# Altium project Course work.PrjPcb (part 2 of 3)
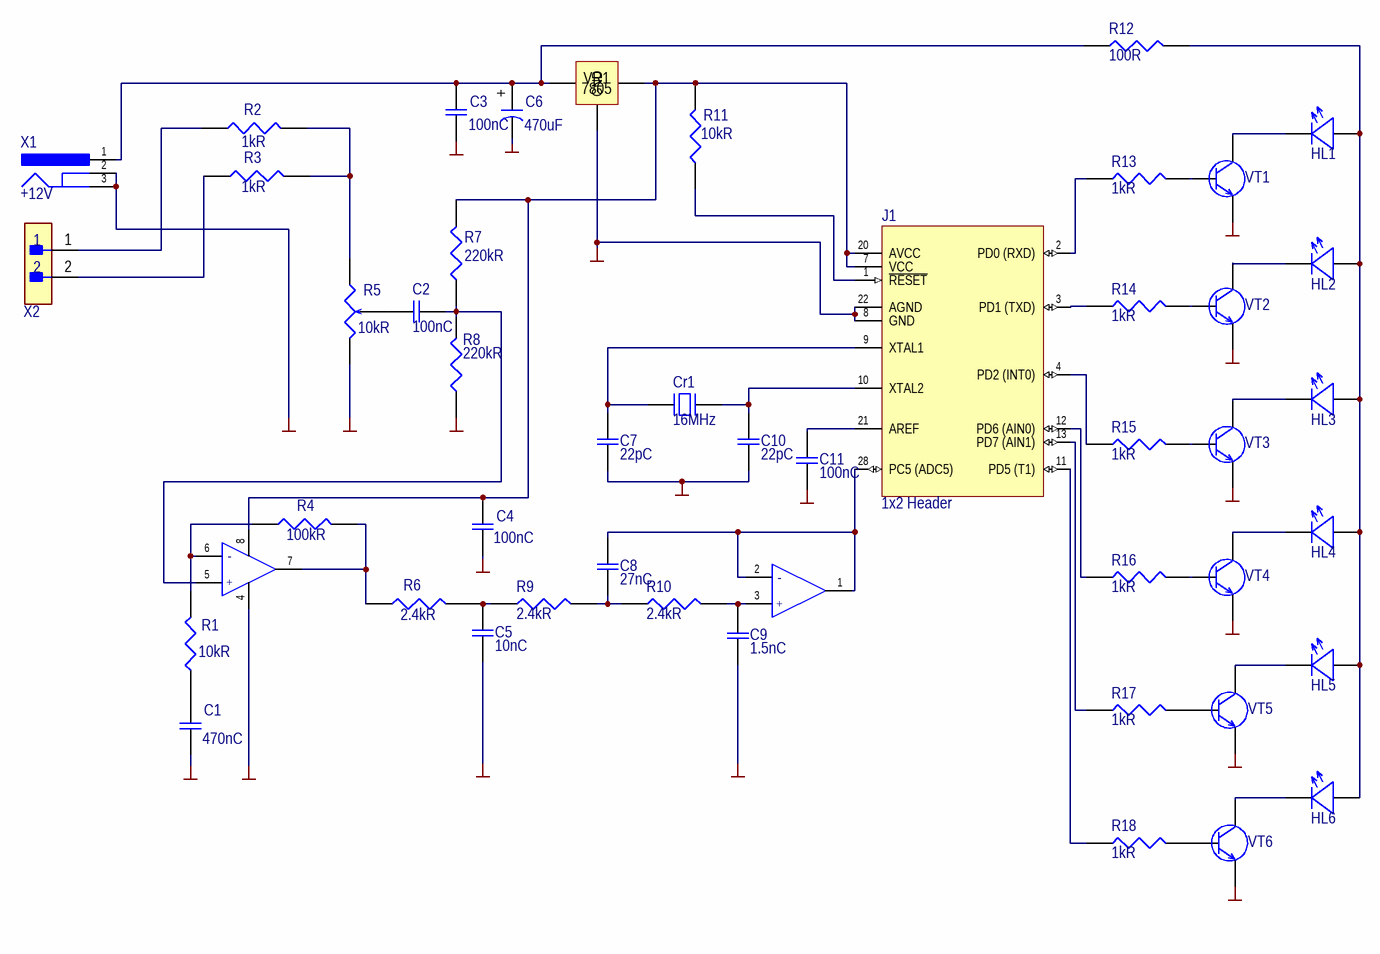
[diagram p1: CW.SchDoc]

## Sheet CW.SchDoc (continued)
### Library data of the parts
C1 = C0805YC474KAT2A: CAP, X7R, 470NF, 16V, 0805, FULL REEL; Manufacturer: Kyocera AVX; Tolerance: 10%; Dissipation Factor: 3.5%; Insulation Resistance: 100GR; Supplier 1: Digi-Key; Supplier Part Number 1: 478-1403-1-ND; Manufacturer Part Number: 0805YC474KAT2A; RoHS: Yes; Category: Ceramic Capacitors; Stock 1: 8545; Pricing 1: 1=0,27000, 10=0,18100, 50=0,10840, 100=0,09160, 500=0,06268, 1000=0,05544 (USD); Mount: Surface Mount,PCB; Case/Package: 0805; Number of Pins: 2; Case Code (Imperial): 0805; Case Code (Metric): 2012; Contact Plating: Tin,Matte; Min Operating Temperature: -55°C; Max Operating Temperature: 125°C; Packaging: Tape and Reel; Capacitance: 470nF; Voltage Rating: 16V; Dielectric: X7R; Voltage: 16V; Voltage Rating (DC): 16V; Package Quantity: 1; Termination: SMD/SMT; Series: -; Construction: Flat; Length: 2.01mm; Width: 1.25mm; Height: 1.4mm; Depth: 1.25mm; Thickness: 0.055inch; Size: 1.4mm; Radiation Hardening: No; RoHS Compliant: Yes; REACH SVHC: No SVHC; Lead Free: Lead Free; ComponentLink1URL: https://datasheet.ciiva.com/19476/2011221-19476183.pdf?src-supplier=Jameco; ComponentLink1Description: https://datasheet.ciiva.com/19476/2011221-19476183.pdf?src-supplier=Jameco; ComponentLink2URL: https://datasheet.ciiva.com/11786/0900766b80ed4be2-11786321.pdf?src-supplier=RSComponents; ComponentLink2Description: https://datasheet.ciiva.com/11786/0900766b80ed4be2-11786321.pdf?src-supplier=RSComponents; ComponentLink3URL: https://datasheet.ciiva.com/2988/cx7r-2988058.pdf?src-supplier=Avnet; ComponentLink3Description: https://datasheet.ciiva.com/2988/cx7r-2988058.pdf?src-supplier=Avnet; ComponentLink4URL: https://datasheet.ciiva.com/16326/cx7r-16326277.pdf?src-supplier=Future+Electronics; ComponentLink4Description: https://datasheet.ciiva.com/16326/cx7r-16326277.pdf?src-supplier=Future+Electronics; ComponentLink5URL: https://datasheet.ciiva.com/16623/cx7r-16623416.pdf?src-supplier=Avnet+Europe; ComponentLink5Description: https://datasheet.ciiva.com/16623/cx7r-16623416.pdf?src-supplier=Avnet+Europe; ComponentLink6URL: https://datasheet.ciiva.com/16544/cx7r-16544108.pdf?src-supplier=Avnet+Asia; ComponentLink6Description: https://datasheet.ciiva.com/16544/cx7r-16544108.pdf?src-supplier=Avnet+Asia; ComponentLink7URL: https://datasheet.ciiva.com/7812/cx7r-7812207.pdf?src-supplier=Element14; ComponentLink7Description: https://datasheet.ciiva.com/7812/cx7r-7812207.pdf?src-supplier=Element14; ComponentLink8URL: https://datasheet.ciiva.com/152/cx7r-152109.pdf?src-supplier=Digi-Key; ComponentLink8Description: https://datasheet.ciiva.com/152/cx7r-152109.pdf?src-supplier=Digi-Key; ComponentLink9URL: https://datasheet.ciiva.com/152/cx7r-152108.pdf?src-supplier=Digi-Key; ComponentLink9Description: https://datasheet.ciiva.com/152/cx7r-152108.pdf?src-supplier=Digi-Key; ComponentLink10URL: https://datasheet.ciiva.com/152/cx7r-152110.pdf?src-supplier=Digi-Key; ComponentLink10Description: https://datasheet.ciiva.com/152/cx7r-152110.pdf?src-supplier=Digi-Key; ComponentLink11URL: https://datasheet.ciiva.com/5416/cx7r-218113-5416693.pdf?src-supplier=Mouser; ComponentLink11Description: https://datasheet.ciiva.com/5416/cx7r-218113-5416693.pdf?src-supplier=Mouser; ComponentLink12URL: https://datasheet.ciiva.com/14590/70001075-14590213.pdf?src-supplier=Allied+Electronics; ComponentLink12Description: https://datasheet.ciiva.com/14590/70001075-14590213.pdf?src-supplier=Allied+Electronics; ComponentLink13URL: https://datasheet.ciiva.com/14602/70001075-14602165.pdf?src-supplier=Allied+Electronics; ComponentLink13Description: https://datasheet.ciiva.com/14602/70001075-14602165.pdf?src-supplier=Allied+Electronics
C2-C4 C11 = C0805C104M4VACTU: CAP CER 0.1UF 16V 20% Y5V 0805; Manufacturer: KEMET; Dielectric Material: Ceramic; Capacitance: 100nF; Dissipation Factor: 7%; Supplier 1: Digi-Key; Supplier Part Number 1: 399-9156-1-ND; Manufacturer Part Number: C0805C104M4VACTU; RoHS: Yes; Category: Ceramic Capacitors; Stock 1: 9052; Pricing 1: 1=0,13000, 10=0,09600, 50=0,05440, 100=0,04500, 500=0,03156, 1000=0,02613 (USD); Mount: Surface Mount; Case/Package: 0805; Case Code (Metric): 2012; Case Code (Imperial): 0805; Min Operating Temperature: -30°C; Max Operating Temperature: 85°C; Package Quantity: 1; Voltage Rating: 16V; Tolerance: 20%; Packaging: Tape and Reel; Voltage Rating (DC): 16V; Dielectric: Y5V; Termination: SMD/SMT; Series: C; Length: 0.079inch; Width: 0.049inch; Height: 0.9mm; Thickness: 0.035inch; Lead Pitch: 0.75mm; Depth: 1.25mm; Lead Free: Lead Free; RoHS Compliant: Yes; ComponentLink1URL: http://www.mouser.com/ds/2/212/KEM_C1005_Y5V_SMD-1101305.pdf?src-supplier=Mouser; ComponentLink1Description: http://www.mouser.com/ds/2/212/KEM_C1005_Y5V_SMD-1101305.pdf?src-supplier=Mouser; ComponentLink2URL: https://api.kemet.com/component-edge/download/datasheet/C0805C104M4VACTU.pdf?src-supplier=Digi-Key; ComponentLink2Description: https://api.kemet.com/component-edge/download/datasheet/C0805C104M4VACTU.pdf?src-supplier=Digi-Key
C5 = CC0402KRX7R7BB103: CAP CER 10000PF 16V X7R 0402; Manufacturer: Yageo; Capacitance: 10nF; Tolerance: 10%; Insulation Resistance: 10GR; Dissipation Factor: 3.5%; Supplier 1: Future Electronics; Supplier Part Number 1: 9410754; Manufacturer Part Number: CC0402KRX7R7BB103; RoHS: Yes; Category: Ceramic Capacitors; Stock 1: 39464018; Pricing 1: 1=0,00300, 500=0,00220, 1500=0,00210, 2500=0,00200, 5000=0,00200 (USD); Mount: Surface Mount; Case/Package: 0402; Number of Pins: 2; Case Code (Metric): 1005; Case Code (Imperial): 0402; Min Operating Temperature: -55°C; Max Operating Temperature: 125°C; Packaging: Tape and Reel; Voltage Rating (DC): 16V; Dielectric: X7R; Voltage: 16V; Package Quantity: 1; Voltage Rating: 16V; Termination: SMD/SMT; Series: CC; Length: 1mm; Width: 0.02inch; Height: 0.5mm; Thickness: 0.022inch; Depth: 0.5mm; Radiation Hardening: No; REACH SVHC: No SVHC; Lead Free: Lead Free; RoHS Compliant: Yes; Halogen Free: Halogen Free; ComponentLink1URL: https://datasheet.ciiva.com/143/upy-gphc-x7r-6-3v-to-50v-8-143952.pdf?src-supplier=Digi-Key; ComponentLink1Description: https://datasheet.ciiva.com/143/upy-gphc-x7r-6-3v-to-50v-8-143952.pdf?src-supplier=Digi-Key; ComponentLink2URL: https://datasheet.ciiva.com/143/mlccorderingcode-143950.pdf?src-supplier=Digi-Key; ComponentLink2Description: https://datasheet.ciiva.com/143/mlccorderingcode-143950.pdf?src-supplier=Digi-Key; ComponentLink3URL: https://datasheet.ciiva.com/143/mlccorderingcode-143951.pdf?src-supplier=Digi-Key; ComponentLink3Description: https://datasheet.ciiva.com/143/mlccorderingcode-143951.pdf?src-supplier=Digi-Key; ComponentLink4URL: https://datasheet.ciiva.com/16625/upy-gphc-x7r-6-3v-to-50v-8-16625510.pdf?src-supplier=Avnet+Europe; ComponentLink4Description: https://datasheet.ciiva.com/16625/upy-gphc-x7r-6-3v-to-50v-8-16625510.pdf?src-supplier=Avnet+Europe; ComponentLink5URL: https://datasheet.ciiva.com/8033/70765-8033655.pdf?src-supplier=Element14; ComponentLink5Description: https://datasheet.ciiva.com/8033/70765-8033655.pdf?src-supplier=Element14; ComponentLink6URL: https://datasheet.ciiva.com/8033/1489800-8033658.pdf?src-supplier=Element14; ComponentLink6Description: https://datasheet.ciiva.com/8033/1489800-8033658.pdf?src-supplier=Element14; ComponentLink7URL: https://datasheet.ciiva.com/28450/1489800-28450330.pdf?src-supplier=Element14; ComponentLink7Description: https://datasheet.ciiva.com/28450/1489800-28450330.pdf?src-supplier=Element14; ComponentLink8URL: https://datasheet.ciiva.com/8033/1489800-8033659.pdf?src-supplier=Element14; ComponentLink8Description: https://datasheet.ciiva.com/8033/1489800-8033659.pdf?src-supplier=Element14; ComponentLink9URL: https://datasheet.ciiva.com/7978/1489800-7978109.pdf?src-supplier=Element14; ComponentLink9Description: https://datasheet.ciiva.com/7978/1489800-7978109.pdf?src-supplier=Element14; ComponentLink10URL: https://datasheet.ciiva.com/5425/upy-gp-np0-16v-to-50v-8-3714-5425438.pdf?src-supplier=Mouser; ComponentLink10Description: https://datasheet.ciiva.com/5425/upy-gp-np0-16v-to-50v-8-3714-5425438.pdf?src-supplier=Mouser
C6 = EEEFK1C471P: PANASONIC - EEEFK1C471P - SMD Aluminum Electrolytic Capacitor, Radial Can - SMD, 470 µF, 16 V, FK Series, 2000 hours @ 105°C; Dielectric Material: Aluminium; Voltage Rating: 16V; Ripple Current: 600mA; Tolerance: 20%; Leakage Current: 3uA; ESR (Equivalent Series Resistance): 160mR; Supplier 1: RSComponents; Supplier Part Number 1: 5370477P; Manufacturer: Panasonic; Manufacturer Part Number: EEEFK1C471P; RoHS: Yes; Category: Aluminum Electrolytic Capacitors; Stock 1: 30580; Pricing 1: 50=0,38600, 150=0,32900 (USD); Mount: Surface Mount,PCB; Case/Package: Radial; Number of Pins: 2; Contact Plating: Tin; Material: Aluminium; Min Operating Temperature: -55°C; Max Operating Temperature: 105°C; Capacitance: 470uF; Packaging: Tape and Reel; Package Quantity: 1; Voltage Rating (DC): 16V; Life (Hours): 2000Hour; Termination: SMD/SMT; Ripple Current (AC): 600mA; Series: FK; Construction: Cylindrical; Voltage: 16V; Impedance: 160mR; Diameter: 8mm; Length: 10.2mm; Width: 10mm; Height: 10.2mm; Height - Seated (Max): 0.402inch; Radiation Hardening: No; REACH SVHC: No SVHC; Lead Free: Lead Free; RoHS Compliant: Yes; ComponentLink1URL: https://datasheet.ciiva.com/11777/0900766b80e4e8b0-11777355.pdf?src-supplier=RSComponents; ComponentLink1Description: https://datasheet.ciiva.com/11777/0900766b80e4e8b0-11777355.pdf?src-supplier=RSComponents; ComponentLink2URL: https://datasheet.ciiva.com/29313/443466-da-01-en-smd-elko-vfk-f-470-uf-16v-29313494.pdf?src-supplier=Conrad; ComponentLink2Description: https://datasheet.ciiva.com/29313/443466-da-01-en-smd-elko-vfk-f-470-uf-16v-29313494.pdf?src-supplier=Conrad; ComponentLink3URL: https://datasheet.ciiva.com/15165/getdatasheetpartid-85020-15165862.pdf?src-supplier=Verical; ComponentLink3Description: https://datasheet.ciiva.com/15165/getdatasheetpartid-85020-15165862.pdf?src-supplier=Verical; ComponentLink4URL: https://datasheet.ciiva.com/2983/aba0000ce120-2983946.pdf?src-supplier=Avnet; ComponentLink4Description: https://datasheet.ciiva.com/2983/aba0000ce120-2983946.pdf?src-supplier=Avnet; ComponentLink5URL: https://datasheet.ciiva.com/14592/70258115-14592955.pdf?src-supplier=Allied+Electronics; ComponentLink5Description: https://datasheet.ciiva.com/14592/70258115-14592955.pdf?src-supplier=Allied+Electronics; ComponentLink6URL: https://datasheet.ciiva.com/6121/1676921-6121148.pdf?src-supplier=Farnell; ComponentLink6Description: https://datasheet.ciiva.com/6121/1676921-6121148.pdf?src-supplier=Farnell; ComponentLink7URL: https://datasheet.ciiva.com/14595/70258115-14595868.pdf?src-supplier=Allied+Electronics; ComponentLink7Description: https://datasheet.ciiva.com/14595/70258115-14595868.pdf?src-supplier=Allied+Electronics; ComponentLink8URL: https://datasheet.ciiva.com/30213/aba0000ce120-30213244.pdf?src-supplier=Onlinecomponents.com; ComponentLink8Description: https://datasheet.ciiva.com/30213/aba0000ce120-30213244.pdf?src-supplier=Onlinecomponents.com; ComponentLink9URL: https://datasheet.ciiva.com/46376/1676921-46376492.pdf?src-supplier=Element14; ComponentLink9Description: https://datasheet.ciiva.com/46376/1676921-46376492.pdf?src-supplier=Element14; ComponentLink10URL: https://datasheet.ciiva.com/2985/aba0000ce120-2985405.pdf?src-supplier=Avnet; ComponentLink10Description: https://datasheet.ciiva.com/2985/aba0000ce120-2985405.pdf?src-supplier=Avnet; ComponentLink11URL: https://datasheet.ciiva.com/25899/aba0000ce120-25899342.pdf?src-supplier=Avnet+Europe; ComponentLink11Description: https://datasheet.ciiva.com/25899/aba0000ce120-25899342.pdf?src-supplier=Avnet+Europe
C7 C10 = C1206C220J5GACTU: 1206 22pF Ceramic Multilayer Capacitor; 50VDC; 125degC; C0G Dielec; +/-5% SMD; Manufacturer: KEMET; Tolerance: 5%; Voltage Rating: 50V; Temperature Coefficient: 30ppm/°C; Dissipation Factor: 0.1%; Supplier 1: Digi-Key; Supplier Part Number 1: 399-1197-1-ND; Manufacturer Part Number: C1206C220J5GACTU; RoHS: Yes; Category: Ceramic Capacitors; Stock 1: 60049; Pricing 1: 1=0,25000, 10=0,16700, 50=0,10040, 100=0,08480, 500=0,05800, 1000=0,05131 (USD); Mount: Surface Mount,PCB; Case/Package: 1206; Case Code (Imperial): 1206; Case Code (Metric): 3216; Dielectric Material: Ceramic; Contact Material: Tin; Min Operating Temperature: -55°C; Max Operating Temperature: 125°C; Capacitance: 22pF; Packaging: Tape and Reel; Dielectric: C0G; Termination: SMD/SMT; Package Quantity: 1; Voltage: 50V; Voltage Rating (DC): 50V; Series: C; Construction: Flat; Length: 3.2mm; Width: 1.6mm; Height: 0.78mm; Depth: 1.6mm; Thickness: 0.035inch; Radiation Hardening: No; REACH SVHC: No SVHC; RoHS Compliant: Yes; Lead Free: Lead Free; ComponentLink1URL: https://datasheet.ciiva.com/6177/1776099-6177664.pdf?src-supplier=Farnell; ComponentLink1Description: https://datasheet.ciiva.com/6177/1776099-6177664.pdf?src-supplier=Farnell; ComponentLink2URL: https://datasheet.ciiva.com/145/docfinderpartnumber-c1206c220j5gactu-145591.pdf?src-supplier=Digi-Key; ComponentLink2Description: https://datasheet.ciiva.com/145/docfinderpartnumber-c1206c220j5gactu-145591.pdf?src-supplier=Digi-Key; ComponentLink3URL: https://datasheet.ciiva.com/7729/1776099-7729850.pdf?src-supplier=Element14; ComponentLink3Description: https://datasheet.ciiva.com/7729/1776099-7729850.pdf?src-supplier=Element14; ComponentLink4URL: https://datasheet.ciiva.com/28668/1789732-28668845.pdf?src-supplier=Element14; ComponentLink4Description: https://datasheet.ciiva.com/28668/1789732-28668845.pdf?src-supplier=Element14; ComponentLink5URL: https://datasheet.ciiva.com/14593/70095383-14593639.pdf?src-supplier=Allied+Electronics; ComponentLink5Description: https://datasheet.ciiva.com/14593/70095383-14593639.pdf?src-supplier=Allied+Electronics; ComponentLink6URL: https://datasheet.ciiva.com/14608/70095383-14608661.pdf?src-supplier=Allied+Electronics; ComponentLink6Description: https://datasheet.ciiva.com/14608/70095383-14608661.pdf?src-supplier=Allied+Electronics; ComponentLink7URL: https://datasheet.ciiva.com/2988/kem-c1003-c0g-smd-2988752.pdf?src-supplier=Avnet; ComponentLink7Description: https://datasheet.ciiva.com/2988/kem-c1003-c0g-smd-2988752.pdf?src-supplier=Avnet; ComponentLink8URL: https://datasheet.ciiva.com/2988/kem-c1003-c0g-smd-2988751.pdf?src-supplier=Avnet; ComponentLink8Description: https://datasheet.ciiva.com/2988/kem-c1003-c0g-smd-2988751.pdf?src-supplier=Avnet; ComponentLink9URL: https://datasheet.ciiva.com/18102/getdatasheetpartid-68144-18102364.pdf?src-supplier=Verical; ComponentLink9Description: https://datasheet.ciiva.com/18102/getdatasheetpartid-68144-18102364.pdf?src-supplier=Verical; ComponentLink10URL: https://datasheet.ciiva.com/11649/kem-c1003-c0g-smd-11649994.pdf?src-supplier=Avnet; ComponentLink10Description: https://datasheet.ciiva.com/11649/kem-c1003-c0g-smd-11649994.pdf?src-supplier=Avnet
C8 = C0805C273K5RACTU: CAP CER 0.027UF 50V X7R 0805; Manufacturer: KEMET; Dielectric Material: Ceramic; Capacitance: 27nF; Tolerance: 10%; Dissipation Factor: 2.5%; Supplier 1: Digi-Key; Supplier Part Number 1: 399-1164-1-ND; Manufacturer Part Number: C0805C273K5RACTU; RoHS: Yes; Category: Ceramic Capacitors; Stock 1: 100815; Pricing 1: 1=0,11000, 10=0,08100, 50=0,04580, 100=0,03800, 500=0,02666, 1000=0,02207 (USD); Mount: Surface Mount,PCB; Case/Package: 0805; Number of Pins: 2; Case Code (Metric): 2012; Case Code (Imperial): 0805; Min Operating Temperature: -55°C; Max Operating Temperature: 125°C; Voltage Rating: 50V; Packaging: Tape and Reel; Package Quantity: 1; Voltage Rating (DC): 50V; Dielectric: X7R; Termination: SMD/SMT; Series: C; Construction: Flat; Voltage: 50V; Length: 2mm; Width: 0.049inch; Height: 0.78mm; Thickness: 0.035inch; Depth: 1.25mm; Lead Pitch: 0.75mm; Radiation Hardening: No; RoHS Compliant: Yes; REACH SVHC: No SVHC; ComponentLink1URL: https://datasheet.ciiva.com/14593/70095383-14593543.pdf?src-supplier=Allied+Electronics; ComponentLink1Description: https://datasheet.ciiva.com/14593/70095383-14593543.pdf?src-supplier=Allied+Electronics; ComponentLink2URL: https://datasheet.ciiva.com/14592/70095383-14592123.pdf?src-supplier=Allied+Electronics; ComponentLink2Description: https://datasheet.ciiva.com/14592/70095383-14592123.pdf?src-supplier=Allied+Electronics; ComponentLink3URL: https://datasheet.ciiva.com/7842/1918693-7842589.pdf?src-supplier=Element14; ComponentLink3Description: https://datasheet.ciiva.com/7842/1918693-7842589.pdf?src-supplier=Element14; ComponentLink4URL: https://datasheet.ciiva.com/7842/kem-c1002-x7r-smd-7842590.pdf?src-supplier=Element14; ComponentLink4Description: https://datasheet.ciiva.com/7842/kem-c1002-x7r-smd-7842590.pdf?src-supplier=Element14
C9 = C08051C152KAT2A: 0805 1.5nF Ceramic Multilayer Capacitor,  100 VDC,  +125degC,  X7R Dielec,  +/-10%; Manufacturer: Kyocera AVX; Tolerance: 10%; Voltage Rating (DC): 100V; Dissipation Factor: 2.5%; Insulation Resistance: 100GR; Supplier 1: Digi-Key; Supplier Part Number 1: 478-1353-1-ND; Manufacturer Part Number: 08051C152KAT2A; RoHS: Yes; Category: Ceramic Capacitors; Stock 1: 214; Pricing 1: 1=0,19000, 10=0,13200, 50=0,07480, 100=0,06200, 500=0,04350, 1000=0,03601 (USD); Mount: Surface Mount,PCB; Case/Package: 0805; Number of Pins: 2; Case Code (Metric): 2012; Case Code (Imperial): 0805; Dielectric Material: Ceramic; Contact Plating: Tin,Matte; Min Operating Temperature: -55°C; Max Operating Temperature: 125°C; Packaging: Tape and Reel; Capacitance: 1.5nF; Package Quantity: 1; Dielectric: X7R; Voltage Rating: 100V; Termination: SMD/SMT; Voltage: 100V; Length: 2.01mm; Width: 0.049inch; Height: 0.94mm; Thickness: 0.037inch; Depth: 1.25mm; Radiation Hardening: No; RoHS Compliant: Yes; REACH SVHC: No SVHC; Lead Free: Lead Free; ComponentLink1URL: https://datasheet.ciiva.com/150/cx7r-150629.pdf?src-supplier=Digi-Key; ComponentLink1Description: https://datasheet.ciiva.com/150/cx7r-150629.pdf?src-supplier=Digi-Key; ComponentLink2URL: https://datasheet.ciiva.com/150/cx7r-150630.pdf?src-supplier=Digi-Key; ComponentLink2Description: https://datasheet.ciiva.com/150/cx7r-150630.pdf?src-supplier=Digi-Key; ComponentLink3URL: https://datasheet.ciiva.com/150/cx7r-150631.pdf?src-supplier=Digi-Key; ComponentLink3Description: https://datasheet.ciiva.com/150/cx7r-150631.pdf?src-supplier=Digi-Key; ComponentLink4URL: https://datasheet.ciiva.com/7811/cx7r-7811928.pdf?src-supplier=Element14; ComponentLink4Description: https://datasheet.ciiva.com/7811/cx7r-7811928.pdf?src-supplier=Element14; ComponentLink5URL: https://datasheet.ciiva.com/7811/cx7r-7811929.pdf?src-supplier=Element14; ComponentLink5Description: https://datasheet.ciiva.com/7811/cx7r-7811929.pdf?src-supplier=Element14; ComponentLink6URL: https://datasheet.ciiva.com/7811/cx7r-7811930.pdf?src-supplier=Element14; ComponentLink6Description: https://datasheet.ciiva.com/7811/cx7r-7811930.pdf?src-supplier=Element14
Cr1 = ATS16ASM-1: CRYSTAL 16.0MHZ 20PF SMD; Manufacturer: CTS; Frequency Tolerance: 30ppm; ESR (Equivalent Series Resistance): 40R; Frequency Stability: 50ppm; Supplier 1: Digi-Key; Supplier Part Number 1: CTX1440CT-ND; Manufacturer Part Number: ATS16ASM-1; RoHS: Yes; Category: Crystals; Stock 1: 949; Pricing 1: 1=0,37000, 10=0,30500, 50=0,27440, 100=0,24400, 500=0,23180 (USD); Mount: Surface Mount; Number of Pins: 2; Min Operating Temperature: -20°C; Max Operating Temperature: 70°C; Frequency: 16MHz; Load Capacitance: 20pF; Packaging: Tape and Reel; Package Quantity: 1000; Tolerance: 30ppm; Termination: SMD/SMT; Series: ATS-SM; Series Resistance: 40R; Length: 0.437inch; Width: 0.19inch; Height: 0.169inch; RoHS Compliant: Yes; ComponentLink1URL: https://datasheet.ciiva.com/861/008-0309-0-861005.pdf?src-supplier=Digi-Key; ComponentLink1Description: https://datasheet.ciiva.com/861/008-0309-0-861005.pdf?src-supplier=Digi-Key
DA1 = LM358N/NOPB (1): TEXAS INSTRUMENTS   LM358N/NOPB..   OP AMP, 1MHZ, 0.1V/S, 7MV, DIP8; Manufacturer: TI National Semiconductor; Slew Rate: 0.1V/µs; Operating Supply Voltage: 16V; Max Supply Voltage: 32V; Min Supply Voltage: 3V; Nominal Supply Current: 500uA; Common Mode Rejection Ratio: 65dB; Voltage Gain: 100dB; Min Dual Supply Voltage: 1.5V; Max Power Dissipation: 830mW; Number of Channels: 2; Output Current: 30mA; Input Bias Current: 250nA; Operating Supply Current: 1mA; Output Current per Channel: 40mA; Max Supply Current: 1.2mA; Supplier 1: Digi-Key; Manufacturer Part Number: LM358N/NOPB; RoHS: Yes; Category: Amplifiers - Op Amps, Buffer, Instrumentation; Stock 1: 24976; Pricing 1: 1=1,00000, 10=0,89100, 25=0,84600, 100=0,69480, 250=0,64952, 500=0,57400, 1000=0,47595 (USD); Mount: Through Hole; Case/Package: PDIP; Number of Pins: 8; Weight: 0.01lb; Min Operating Temperature: 0°C; Max Operating Temperature: 70°C; Bandwidth: 1MHz; Packaging: Rail/Tube; Unity Gain Bandwidth Product: 1MHz; Package Quantity: 40; Max Dual Supply Voltage: 16V; Number of Circuits: 2; Gain Bandwidth Product: 1MHz; Input Offset Voltage (Vos): 7mV; Number of Amplifiers: 2; Number of Elements: 2; Power Dissipation: 830mW; Power Supply Rejection Ratio (PSRR): 65dB; Length: 9.27mm; Width: 6.35mm; Height: 3.3mm; Radiation Hardening: No; REACH SVHC: No SVHC; Lead Free: Lead Free; Supplier Part Number 1: LM358NNS/NOPB-ND
DA2 = LM7805CT/NOPB: Series 3-Terminal Positive Regulators; Manufacturer: Texas Instruments; Number of Outputs: 1; Quiescent Current: 8mA; Output Type: Fixed; Max Input Voltage: 35V; Max Output Current: 1A; Dropout Voltage: 2V; Min Input Voltage: 10V; Accuracy: 2%; Supplier 1: Digi-Key; Manufacturer Part Number: LM7805CT/NOPB; RoHS: Yes; Category: Voltage Regulators - Linear; Stock 1: 13155; Pricing 1: 1=1,63000, 10=1,46300, 25=1,38080, 100=1,17630, 250=1,10452, 500=0,96646, 1000=0,87007 (USD); Mount: Through Hole; Case/Package: TO-220; Number of Pins: 3; Min Operating Temperature: 0°C; Max Operating Temperature: 125°C; Packaging: Rail/Tube; Package Quantity: 45; Polarity: Positive; Series: -; Output Voltage: 5V; Output Current: 1A; Number of Regulators: 1; Output Voltage Accuracy: 2%; Length: 10.16mm; Width: 4.7mm; Height: 8.89mm; Radiation Hardening: No; Lead Free: Contains Lead; RoHS Compliant: Yes; ComponentLink1URL: https://datasheet.ciiva.com/45987/902071-45987836.pdf?src-supplier=Jameco; ComponentLink1Description: https://datasheet.ciiva.com/45987/902071-45987836.pdf?src-supplier=Jameco; ComponentLink2URL: https://datasheet.ciiva.com/15083/lm7805c-15083790.pdf?src-supplier=Digi-Key; ComponentLink2Description: https://datasheet.ciiva.com/15083/lm7805c-15083790.pdf?src-supplier=Digi-Key; ComponentLink3URL: https://datasheet.ciiva.com/14280/lm340-n-14280911.pdf?src-supplier=Avnet; ComponentLink3Description: https://datasheet.ciiva.com/14280/lm340-n-14280911.pdf?src-supplier=Avnet; Supplier Part Number 1: 296-47192-ND
HL1 HL3 = 151051RS11000: WURTH ELEKTRONIK - 151051RS11000 - LED, Red, Through Hole, T-1 3/4 (5mm), 30 mA, 2.1 V, 630 nm; Manufacturer: Wurth Electronics; Forward Voltage: 2.1V; Test Current: 20mA; Luminous Intensity: 30mcd; Viewing Angle: 60°; Lens Style: Diffused,Round,Circular; Dominant Wavelength: 645nm; Forward Current: 30mA; Wavelength: 630nm; Supplier 1: Digi-Key; Supplier Part Number 1: 732-5016-ND; Manufacturer Part Number: 151051RS11000; RoHS: Yes; Category: LEDs; Stock 1: 6443; Pricing 1: 1=0,16000, 50=0,14500, 100=0,12500, 500=0,12000 (USD); Mount: Through Hole; Case/Package: Radial; Color: Red; Min Operating Temperature: -40°C; Max Operating Temperature: 85°C; Package Quantity: 1; Height: 8.9mm; Lens Size: 5mm; RoHS Compliant: Yes; REACH SVHC: Unknown; ComponentLink1URL: https://datasheet.ciiva.com/23843/151051rs11000-23843281.pdf?src-supplier=Newark; ComponentLink1Description: https://datasheet.ciiva.com/23843/151051rs11000-23843281.pdf?src-supplier=Newark; ComponentLink2URL: https://datasheet.ciiva.com/29335/759488-da-01-en-tht-led-5mm-rot-151051rs11000-29335455.pdf?src-supplier=Conrad; ComponentLink2Description: https://datasheet.ciiva.com/29335/759488-da-01-en-tht-led-5mm-rot-151051rs11000-29335455.pdf?src-supplier=Conrad; ComponentLink3URL: https://datasheet.ciiva.com/22657/1911506-22657034.pdf?src-supplier=Element14; ComponentLink3Description: https://datasheet.ciiva.com/22657/1911506-22657034.pdf?src-supplier=Element14; ComponentLink4URL: https://datasheet.ciiva.com/29562/151051rs11000-29562906.pdf?src-supplier=Digi-Key; ComponentLink4Description: https://datasheet.ciiva.com/29562/151051rs11000-29562906.pdf?src-supplier=Digi-Key
HL2 = 151051BS04000: WURTH ELEKTRONIK - 151051BS04000 - LED, 5MM, BLUE, 500MCD, 470NM; Manufacturer: Wurth Electronics; Lens Style: Diffused,Circular,Round; Forward Voltage: 3.2V; Forward Current: 30mA; Viewing Angle: 40°; Test Current: 20mA; Supplier 1: Digi-Key; Supplier Part Number 1: 732-5015-ND; Manufacturer Part Number: 151051BS04000; RoHS: Yes; Category: LEDs; Stock 1: 14295; Pricing 1: 1=0,25000, 50=0,23000, 100=0,19800, 500=0,18600 (USD); Mount: Through Hole; Case/Package: Radial; Color: Blue; Min Operating Temperature: -40°C; Max Operating Temperature: 85°C; Packaging: Bulk; Luminous Intensity: 500mcd; Dominant Wavelength: 470nm; Package Quantity: 1; Wavelength: 470nm; Height: 8.9mm; Lens Size: 5mm; RoHS Compliant: Yes; REACH SVHC: Unknown; ComponentLink1URL: https://datasheet.ciiva.com/23843/151051bs04000-23843280.pdf?src-supplier=Newark; ComponentLink1Description: https://datasheet.ciiva.com/23843/151051bs04000-23843280.pdf?src-supplier=Newark; ComponentLink2URL: https://datasheet.ciiva.com/29363/759492-da-01-en-tht-led-5mm-blau-151051bs04000-29363825.pdf?src-supplier=Conrad; ComponentLink2Description: https://datasheet.ciiva.com/29363/759492-da-01-en-tht-led-5mm-blau-151051bs04000-29363825.pdf?src-supplier=Conrad; ComponentLink3URL: https://datasheet.ciiva.com/29562/151051bs04000-29562902.pdf?src-supplier=Digi-Key; ComponentLink3Description: https://datasheet.ciiva.com/29562/151051bs04000-29562902.pdf?src-supplier=Digi-Key
HL4 HL6 = 151051VS04000: WURTH ELEKTRONIK - 151051VS04000 - LED, Green, Through Hole, T-1 3/4 (5mm), 30 mA, 2.1 V, 572 nm; Manufacturer: Wurth Electronics; Forward Voltage: 2.1V; Luminous Intensity: 140mcd; Forward Current: 30mA; Lens Style: Diffused,Circular,Round; Test Current: 20mA; Dominant Wavelength: 572nm; Viewing Angle: 40°; Supplier 1: Digi-Key; Supplier Part Number 1: 732-5017-ND; Manufacturer Part Number: 151051VS04000; RoHS: Yes; Category: LEDs; Stock 1: 5536; Pricing 1: 1=0,25000, 50=0,23000, 100=0,19800, 500=0,18600 (USD); Mount: Through Hole; Case/Package: Radial; Color: Green; Min Operating Temperature: -40°C; Max Operating Temperature: 85°C; Package Quantity: 1; Wavelength: 572nm; Height: 8.9mm; Lens Size: 5mm; RoHS Compliant: Yes; REACH SVHC: Unknown; ComponentLink1URL: https://datasheet.ciiva.com/23843/151051vs04000-23843282.pdf?src-supplier=Newark; ComponentLink1Description: https://datasheet.ciiva.com/23843/151051vs04000-23843282.pdf?src-supplier=Newark; ComponentLink2URL: https://datasheet.ciiva.com/29363/759491-da-01-en-tht-led-5mm-b-gruen-151051vs04000-29363828.pdf?src-supplier=Conrad; ComponentLink2Description: https://datasheet.ciiva.com/29363/759491-da-01-en-tht-led-5mm-b-gruen-151051vs04000-29363828.pdf?src-supplier=Conrad; ComponentLink3URL: https://datasheet.ciiva.com/29562/151051vs04000-29562903.pdf?src-supplier=Digi-Key; ComponentLink3Description: https://datasheet.ciiva.com/29562/151051vs04000-29562903.pdf?src-supplier=Digi-Key; ComponentLink4URL: https://datasheet.ciiva.com/48429/151051vs04000-eng-tds-48429978.pdf?src-supplier=Distrelec; ComponentLink4Description: https://datasheet.ciiva.com/48429/151051vs04000-eng-tds-48429978.pdf?src-supplier=Distrelec
HL5 = 151051YS04000: WURTH ELEKTRONIK - 151051YS04000 - LED, Yellow, Through Hole, T-1 3/4 (5mm), 30 mA, 2 V, 590 nm; Manufacturer: Wurth Electronics; Luminous Intensity: 450mcd; Viewing Angle: 40°; Forward Voltage: 2V; Lens Style: Diffused,Round,Circular; Test Current: 20mA; Forward Current: 30mA; Wavelength: 590nm; Supplier 1: Digi-Key; Supplier Part Number 1: 732-5018-ND; Manufacturer Part Number: 151051YS04000; RoHS: Yes; Category: LEDs; Stock 1: 1858; Pricing 1: 1=0,21000, 50=0,19800, 100=0,17100, 500=0,16050 (USD); Mount: Through Hole; Case/Package: Radial; Color: Yellow; Min Operating Temperature: -40°C; Max Operating Temperature: 85°C; Package Quantity: 1; Dominant Wavelength: 590nm; Height: 8.9mm; Lens Size: 5mm; RoHS Compliant: Yes; REACH SVHC: Unknown; ComponentLink1URL: https://datasheet.ciiva.com/29562/151051ys04000-29562897.pdf?src-supplier=Digi-Key; ComponentLink1Description: https://datasheet.ciiva.com/29562/151051ys04000-29562897.pdf?src-supplier=Digi-Key; ComponentLink2URL: https://datasheet.ciiva.com/29335/759489-da-01-en-tht-led-5mm-gelb-151051ys04000-29335459.pdf?src-supplier=Conrad; ComponentLink2Description: https://datasheet.ciiva.com/29335/759489-da-01-en-tht-led-5mm-gelb-151051ys04000-29335459.pdf?src-supplier=Conrad; ComponentLink3URL: https://datasheet.ciiva.com/48429/151051ys04000-eng-tds-48429979.pdf?src-supplier=Distrelec; ComponentLink3Description: https://datasheet.ciiva.com/48429/151051ys04000-eng-tds-48429979.pdf?src-supplier=Distrelec
J1 = ATMEGA8A-PU: MCU 8-bit ATmega AVR RISC 8KB Flash 3.3V/5V 28-Pin PDIP; Manufacturer: Microchip / Atmel; Frequency: 16MHz; Interface: SPI,USART,I2C,UART; Number of I/Os: 23; Oscillator Type: Internal; Peripherals: Brown-out Detect/Reset,POR,PWM,WDT; RAM Size: 1KB; Max Supply Voltage: 5.5V; Min Supply Voltage: 2.7V; Number of Timers/Counters: 3; Number of ADC Channels: 6; Data Bus Width: 8b; Number of SPI Channels: 1; Watchdog Timer: Yes; Manufacturer Part Number: ATMEGA8A-PU; RoHS: Yes; Category: Microcontrollers; Stock 1: 7653; Pricing 1: 1=2,66000, 25=2,43120, 100=2,20000 (USD); Mount: Through Hole; Case/Package: PDIP; Number of Pins: 28; Contact Plating: Tin,Matte; Min Operating Temperature: -40°C; Max Operating Temperature: 85°C; Core Architecture: AVR; Packaging: Rail/Tube; Package Quantity: 14; Memory Type: FLASH; Memory Size: 8KB; Number of PWM Channels: 3; Number of Programmable I/O: 23; Max Frequency: 16MHz; Number of I2C Channels: 1; Series: AVR® ATmega; Length: 34.8mm; Width: 7.49mm; Height: 4.572mm; Radiation Hardening: No; REACH SVHC: No SVHC; Lead Free: Lead Free; RoHS Compliant: Yes; ComponentLink1URL: https://datasheet.ciiva.com/15213/getdatasheetpartid-316011-15213203.pdf?src-supplier=Verical; ComponentLink1Description: https://datasheet.ciiva.com/15213/getdatasheetpartid-316011-15213203.pdf?src-supplier=Verical; ComponentLink2URL: https://datasheet.ciiva.com/26818/atmega8a-pu-26818556.pdf?src-supplier=IIIC; ComponentLink2Description: https://datasheet.ciiva.com/26818/atmega8a-pu-26818556.pdf?src-supplier=IIIC; ComponentLink3URL: https://datasheet.ciiva.com/24154/atmel-8159-8-bit-avr-microcontroller-atmega8a-summary-24154172.pdf?src-supplier=Future+Electronics; ComponentLink3Description: https://datasheet.ciiva.com/24154/atmel-8159-8-bit-avr-microcontroller-atmega8a-summary-24154172.pdf?src-supplier=Future+Electronics; ComponentLink4URL: https://datasheet.ciiva.com/6658/8159s-6658029.pdf?src-supplier=Digi-Key; ComponentLink4Description: https://datasheet.ciiva.com/6658/8159s-6658029.pdf?src-supplier=Digi-Key; Parameter 1: *; Parameter 2: *; Supplier 1: Digi-Key; Supplier Part Number 1: ATMEGA8A-PU-ND
R1 R11 = CRCW080510K0JNEAC: Res Thick Film 0805 10K Ohm 5% 1/8W ±200ppm/°C Molded SMD Paper T/R; Manufacturer: Vishay Semiconductors; Power Rating: 125mW; Supplier 1: Digi-Key; Supplier Part Number 1: 541-4163-1-ND; Manufacturer Part Number: CRCW080510K0JNEAC; RoHS: Yes; Category: Resistors; Stock 1: 146; Pricing 1: 1=0,10000, 10=0,04000, 100=0,01630, 1000=0,00731, 2500=0,00635 (USD); Mount: Surface Mount; Case/Package: SMD/SMT; Contact Plating: Tin; Min Operating Temperature: -55°C; Max Operating Temperature: 155°C; Resistor Type: Thick Film; Termination: Wraparound; Resistance: 10kR; Tolerance: 5%; Temperature Coefficient: 200ppm/°C; Length: 2mm; Lead Free: Lead Free; RoHS Compliant: Yes; ComponentLink1URL: http://www.vishay.com/docs/20035/dcrcwe3.pdf?src-supplier=Avnet+Asia; ComponentLink1Description: http://www.vishay.com/docs/20035/dcrcwe3.pdf?src-supplier=Avnet+Asia; ComponentLink2URL: http://www.vishay.com/docs/28773/crcwce3.pdf?src-supplier=Digi-Key; ComponentLink2Description: http://www.vishay.com/docs/28773/crcwce3.pdf?src-supplier=Digi-Key
R2 R3 R13-R18 = CRCW08051K00JNEA: Res Thick Film 0805 1K Ohm 5% 1/8W 200ppm/C Molded SMD SMD Paper T/R; Manufacturer: Vishay Dale; Power Rating: 125mW; Voltage Rating: 150V; Temperature Coefficient: 200ppm/°C; Supplier 1: Digi-Key; Supplier Part Number 1: 541-1.0KACT-ND; Manufacturer Part Number: CRCW08051K00JNEA; RoHS: Yes; Category: Chip SMD Resistors; Stock 1: 2818; Pricing 1: 1=0,10000, 10=0,04200, 100=0,01700, 1000=0,00762, 2500=0,00661 (USD); Mount: Surface Mount; Case/Package: 0805; Number of Pins: 2; Weight: 0.000194oz; Case Code (Imperial): 0805; Case Code (Metric): 2012; Contact Plating: Tin; Size Code: 0805; Min Operating Temperature: -55°C; Max Operating Temperature: 155°C; Packaging: Tape and Reel; Resistance: 1kR; Tolerance: 5%; Package Quantity: 1; Resistor Type: Thick Film; Number of Terminations: 2; Termination: SMD/SMT; Max Power Dissipation: 125mW; Voltage Rating (DC): 150V; Features: Automotive AEC-Q200; Series: CRCW; Construction: Rectangular; Resistance Tolerance: 5%; Length: 2mm; Width: 1.25mm; Height: 0.02inch; Depth: 1.25mm; Radiation Hardening: No; REACH SVHC: Unknown; Military Standard: Not; Lead Free: Lead Free; RoHS Compliant: Yes; ComponentLink1URL: https://datasheet.ciiva.com/8337/dcrcwe3-8337669.pdf?src-supplier=Avnet; ComponentLink1Description: https://datasheet.ciiva.com/8337/dcrcwe3-8337669.pdf?src-supplier=Avnet; ComponentLink2URL: https://datasheet.ciiva.com/5544/dcrcwe3-109170-5544649.pdf?src-supplier=Mouser; ComponentLink2Description: https://datasheet.ciiva.com/5544/dcrcwe3-109170-5544649.pdf?src-supplier=Mouser; ComponentLink3URL: https://datasheet.ciiva.com/2463/dcrcwe3-2463178.pdf?src-supplier=Digi-Key; ComponentLink3Description: https://datasheet.ciiva.com/2463/dcrcwe3-2463178.pdf?src-supplier=Digi-Key; ComponentLink4URL: https://datasheet.ciiva.com/2463/dcrcwe3-2463179.pdf?src-supplier=Digi-Key; ComponentLink4Description: https://datasheet.ciiva.com/2463/dcrcwe3-2463179.pdf?src-supplier=Digi-Key; ComponentLink5URL: https://datasheet.ciiva.com/46441/1533075-46441628.pdf?src-supplier=Element14; ComponentLink5Description: https://datasheet.ciiva.com/46441/1533075-46441628.pdf?src-supplier=Element14; ComponentLink6URL: https://datasheet.ciiva.com/3258/dcrcwe3-3258221.pdf?src-supplier=Avnet; ComponentLink6Description: https://datasheet.ciiva.com/3258/dcrcwe3-3258221.pdf?src-supplier=Avnet; ComponentLink7URL: https://datasheet.ciiva.com/16755/70201119-16755757.pdf?src-supplier=Allied+Electronics; ComponentLink7Description: https://datasheet.ciiva.com/16755/70201119-16755757.pdf?src-supplier=Allied+Electronics; ComponentLink8URL: https://datasheet.ciiva.com/16435/dcrcwe3-16435934.pdf?src-supplier=Future+Electronics; ComponentLink8Description: https://datasheet.ciiva.com/16435/dcrcwe3-16435934.pdf?src-supplier=Future+Electronics; ComponentLink9URL: https://datasheet.ciiva.com/17204/dcrcwe3-17204398.pdf?src-supplier=Avnet+Europe; ComponentLink9Description: https://datasheet.ciiva.com/17204/dcrcwe3-17204398.pdf?src-supplier=Avnet+Europe; Parameter 1: *; Parameter 2: *; Parameter 3: *; Parameter 4: *
R4 = CRCW0805100KJNEB: Res Thick Film 0805 100K Ohm 5% 1/8W 200ppm/C Molded SMD SMD Paper T/R; Manufacturer: Vishay Dale; Power Rating: 125mW; Voltage Rating: 150V; Temperature Coefficient: 200ppm/°C; Supplier 1: Digi-Key; Supplier Part Number 1: 541-CRCW0805100KJNEBCT-ND; Manufacturer Part Number: CRCW0805100KJNEB; RoHS: Yes; Category: Chip SMD Resistors; Stock 1: 14812; Pricing 1: 1=0,10000, 10=0,04200, 100=0,01700, 1000=0,00762, 2500=0,00661, 5000=0,00546 (USD); Case/Package: 0805; Number of Pins: 2; Weight: 0.000194oz; Case Code (Imperial): 0805; Case Code (Metric): 2012; Contact Plating: Tin; Min Operating Temperature: -55°C; Max Operating Temperature: 155°C; Resistance: 100kR; Tolerance: 5%; Packaging: Tape and Reel; Package Quantity: 10000; Resistor Type: Thick Film; Number of Terminations: 2; Max Power Dissipation: 125mW; Voltage Rating (DC): 150V; Features: Automotive AEC-Q200; Series: CRCW; Resistance Tolerance: 5%; Length: 0.079inch; Width: 0.049inch; Height: 0.02inch; Radiation Hardening: No; REACH SVHC: Unknown; Lead Free: Lead Free; RoHS Compliant: Yes; ComponentLink1URL: https://datasheet.ciiva.com/5543/dcrcwe3-109170-5543783.pdf?src-supplier=Mouser; ComponentLink1Description: https://datasheet.ciiva.com/5543/dcrcwe3-109170-5543783.pdf?src-supplier=Mouser; ComponentLink2URL: https://datasheet.ciiva.com/8982/dcrcwe3-8982399.pdf?src-supplier=Avnet; ComponentLink2Description: https://datasheet.ciiva.com/8982/dcrcwe3-8982399.pdf?src-supplier=Avnet
R5 = 3313J-1-103E: BOURNS 3313J-1-103E             TRIMMER, 10KOHM, 125mW, SMD; Tolerance: 20%; Number of Turns: 1; Temperature Coefficient: 100ppm/°C; Voltage Rating (DC): 500V; Insulation Resistance: 100MR; Supplier 1: Digi-Key; Supplier Part Number 1: 3313J-103ECT-ND; Manufacturer: Bourns; Manufacturer Part Number: 3313J-1-103E; RoHS: Yes; Category: Variable Resistors and Potentiometers; Stock 1: 968; Pricing 1: 1=1,82000, 10=1,59500, 25=1,43000, 50=1,37500, 100=1,32000, 250=1,26500, 500=1,04500 (USD); Mount: Surface Mount; Weight: 283mg; Color: Natural; Min Operating Temperature: -55°C; Max Operating Temperature: 125°C; Package Quantity: 1000; Resistance: 10kR; Power Rating: 125mW; Packaging: Tape and Reel; Resistor Type: Cermet; Termination: J-Hook; Max Power Dissipation: 125mW; Series: Trimpot® 3313 - Sealed; Technology: CERMET; Taper: Linear; Type: Potentiometer; Resistance Tolerance: 20%; Length: 3.2mm; Width: 0.126inch; Height: 2.2mm; Depth: 3.5mm; Radiation Hardening: No; Military Standard: Not; REACH SVHC: No SVHC; Lead Free: Lead Free; RoHS Compliant: Yes; ComponentLink1URL: https://datasheet.ciiva.com/6197/1719390-6197392.pdf?src-supplier=Farnell; ComponentLink1Description: https://datasheet.ciiva.com/6197/1719390-6197392.pdf?src-supplier=Farnell; ComponentLink2URL: https://datasheet.ciiva.com/11831/0900766b80dbb89c-11831555.pdf?src-supplier=RSComponents; ComponentLink2Description: https://datasheet.ciiva.com/11831/0900766b80dbb89c-11831555.pdf?src-supplier=RSComponents; ComponentLink3URL: https://datasheet.ciiva.com/2156/3313-2156354.pdf?src-supplier=Digi-Key; ComponentLink3Description: https://datasheet.ciiva.com/2156/3313-2156354.pdf?src-supplier=Digi-Key; ComponentLink4URL: https://datasheet.ciiva.com/2156/3313-2156355.pdf?src-supplier=Digi-Key; ComponentLink4Description: https://datasheet.ciiva.com/2156/3313-2156355.pdf?src-supplier=Digi-Key; ComponentLink5URL: https://datasheet.ciiva.com/2156/3313-2156356.pdf?src-supplier=Digi-Key; ComponentLink5Description: https://datasheet.ciiva.com/2156/3313-2156356.pdf?src-supplier=Digi-Key; ComponentLink6URL: https://datasheet.ciiva.com/43573/1157501-43573718.pdf?src-supplier=Jameco; ComponentLink6Description: https://datasheet.ciiva.com/43573/1157501-43573718.pdf?src-supplier=Jameco; ComponentLink7URL: https://datasheet.ciiva.com/28659/1770668-28659191.pdf?src-supplier=Element14; ComponentLink7Description: https://datasheet.ciiva.com/28659/1770668-28659191.pdf?src-supplier=Element14; ComponentLink8URL: https://datasheet.ciiva.com/16812/3313-16812088.pdf?src-supplier=Avnet+Europe; ComponentLink8Description: https://datasheet.ciiva.com/16812/3313-16812088.pdf?src-supplier=Avnet+Europe; ComponentLink9URL: https://datasheet.ciiva.com/7953/1864507-7953225.pdf?src-supplier=Element14; ComponentLink9Description: https://datasheet.ciiva.com/7953/1864507-7953225.pdf?src-supplier=Element14; ComponentLink10URL: https://datasheet.ciiva.com/16715/70153423-16715693.pdf?src-supplier=Allied+Electronics; ComponentLink10Description: https://datasheet.ciiva.com/16715/70153423-16715693.pdf?src-supplier=Allied+Electronics
R6 R9 R10 = CRCW08052K40JNEA: Resistor,Metal Glaze,2.4KOhms,150WV,5+/-% Tol,-200,200ppm-TC,0805-Case ;RoHS Compliant: Yes; Manufacturer: Vishay Dale; Tolerance: 5%; Power Rating: 125mW; Voltage Rating: 150V; Temperature Coefficient: 200ppm/°C; Supplier 1: Digi-Key; Supplier Part Number 1: 541-2.4KACT-ND; Manufacturer Part Number: CRCW08052K40JNEA; RoHS: Yes; Category: Chip SMD Resistors; Stock 1: 1280; Pricing 1: 1=0,10000, 10=0,04200, 100=0,01700, 1000=0,00762, 2500=0,00661 (USD); Case/Package: 0805; Number of Pins: 2; Weight: 0.000194oz; Case Code (Imperial): 0805; Case Code (Metric): 2012; Contact Plating: Tin; Size Code: 0805; Min Operating Temperature: -55°C; Max Operating Temperature: 155°C; Resistance: 2.4kR; Packaging: Tape and Reel; Package Quantity: 1; Termination: SMD/SMT; Resistor Type: Thick Film; Number of Terminations: 2; Max Power Dissipation: 125mW; Voltage Rating (DC): 150V; Features: Automotive AEC-Q200; Series: CRCW; Construction: Rectangular; Resistance Tolerance: 5%; Length: 2mm; Width: 1.25mm; Height: 0.02inch; Depth: 1.25mm; Radiation Hardening: No; REACH SVHC: Unknown; Military Standard: Not; Lead Free: Lead Free; RoHS Compliant: Yes; ComponentLink1URL: https://datasheet.ciiva.com/2525/dcrcwe3-2525095.pdf?src-supplier=Digi-Key; ComponentLink1Description: https://datasheet.ciiva.com/2525/dcrcwe3-2525095.pdf?src-supplier=Digi-Key; ComponentLink2URL: https://datasheet.ciiva.com/2525/dcrcwe3-2525096.pdf?src-supplier=Digi-Key; ComponentLink2Description: https://datasheet.ciiva.com/2525/dcrcwe3-2525096.pdf?src-supplier=Digi-Key; ComponentLink3URL: https://datasheet.ciiva.com/2525/dcrcwe3-2525097.pdf?src-supplier=Digi-Key; ComponentLink3Description: https://datasheet.ciiva.com/2525/dcrcwe3-2525097.pdf?src-supplier=Digi-Key; ComponentLink4URL: https://datasheet.ciiva.com/3258/dcrcwe3-3258442.pdf?src-supplier=Avnet; ComponentLink4Description: https://datasheet.ciiva.com/3258/dcrcwe3-3258442.pdf?src-supplier=Avnet; ComponentLink5URL: https://datasheet.ciiva.com/3258/dcrcwe3-3258443.pdf?src-supplier=Avnet; ComponentLink5Description: https://datasheet.ciiva.com/3258/dcrcwe3-3258443.pdf?src-supplier=Avnet; ComponentLink6URL: https://datasheet.ciiva.com/16392/dcrcw-16392315.pdf?src-supplier=Future+Electronics; ComponentLink6Description: https://datasheet.ciiva.com/16392/dcrcw-16392315.pdf?src-supplier=Future+Electronics
R7 R8 = CRCW0805220KJNEA: RES SMD 220K OHM 5% 1/8W 0805; Manufacturer: Vishay Dale; Power Rating: 125mW; Voltage Rating: 150V; Temperature Coefficient: 200ppm/°C; Supplier 1: Digi-Key; Supplier Part Number 1: 541-220KACT-ND; Manufacturer Part Number: CRCW0805220KJNEA; RoHS: Yes; Category: Chip SMD Resistors; Stock 1: 1120; Pricing 1: 1=0,10000, 10=0,04200, 100=0,01700, 1000=0,00762, 2500=0,00661 (USD); Mount: Surface Mount; Case/Package: 0805; Weight: 0.000194oz; Case Code (Metric): 2012; Case Code (Imperial): 0805; Contact Plating: Tin; Size Code: 0805; Min Operating Temperature: -55°C; Max Operating Temperature: 155°C; Package Quantity: 1; Resistance: 220kR; Tolerance: 5%; Packaging: Tape and Reel; Resistor Type: Thick Film; Number of Terminations: 2; Termination: SMD/SMT; Max Power Dissipation: 125mW; Voltage Rating (DC): 150V; Features: Automotive AEC-Q200; Series: CRCW; Construction: Rectangular; Resistance Tolerance: 5%; Length: 2mm; Width: 0.049inch; Height: 0.02inch; Depth: 1.25mm; Radiation Hardening: No; REACH SVHC: Unknown; Military Standard: Not; Lead Free: Lead Free; RoHS Compliant: Yes; ComponentLink1URL: https://datasheet.ciiva.com/2464/dcrcwe3-2464864.pdf?src-supplier=Digi-Key; ComponentLink1Description: https://datasheet.ciiva.com/2464/dcrcwe3-2464864.pdf?src-supplier=Digi-Key; ComponentLink2URL: https://datasheet.ciiva.com/2464/dcrcwe3-2464865.pdf?src-supplier=Digi-Key; ComponentLink2Description: https://datasheet.ciiva.com/2464/dcrcwe3-2464865.pdf?src-supplier=Digi-Key; ComponentLink3URL: https://datasheet.ciiva.com/2464/dcrcwe3-2464866.pdf?src-supplier=Digi-Key; ComponentLink3Description: https://datasheet.ciiva.com/2464/dcrcwe3-2464866.pdf?src-supplier=Digi-Key; ComponentLink4URL: https://datasheet.ciiva.com/3258/dcrcwe3-3258325.pdf?src-supplier=Avnet; ComponentLink4Description: https://datasheet.ciiva.com/3258/dcrcwe3-3258325.pdf?src-supplier=Avnet; ComponentLink5URL: https://datasheet.ciiva.com/17166/dcrcwe3-17166711.pdf?src-supplier=Avnet+Europe; ComponentLink5Description: https://datasheet.ciiva.com/17166/dcrcwe3-17166711.pdf?src-supplier=Avnet+Europe; ComponentLink6URL: https://datasheet.ciiva.com/28606/1747939-28606759.pdf?src-supplier=Element14; ComponentLink6Description: https://datasheet.ciiva.com/28606/1747939-28606759.pdf?src-supplier=Element14; ComponentLink7URL: https://datasheet.ciiva.com/16498/dcrcw-16498286.pdf?src-supplier=Future+Electronics; ComponentLink7Description: https://datasheet.ciiva.com/16498/dcrcw-16498286.pdf?src-supplier=Future+Electronics
R12 = ERA-6AEB101V: SISTOR, METAL FILM, 100 OHM, 125mW, 0.1%; Product Range:PANASONIC - ERA Series; Resistance:100ohm; Power Rating:125mW; Resistance Tolerance:± 0.1%; Resistor Case Style:0805 ^2012 Metric]; Resistor Element Type:Thin Film; MSL:-; Voltage Rating: 100V; Temperature Coefficient: 25ppm/°C; Supplier 1: Digi-Key; Supplier Part Number 1: P100DACT-ND; Manufacturer: Panasonic; Manufacturer Part Number: ERA-6AEB101V; RoHS: Yes; Category: Chip SMD Resistors; Stock 1: 69; Pricing 1: 1=0,31000, 10=0,26200, 100=0,10230, 1000=0,04284, 2500=0,03927 (USD); Mount: Surface Mount; Case/Package: 0805; Number of Pins: 2; Case Code (Imperial): 0805; Case Code (Metric): 2012; Size Code: 0805; Contact Plating: Tin; Min Operating Temperature: -55°C; Max Operating Temperature: 155°C; Tolerance: 0.1%; Power Rating: 125mW; Packaging: Tape and Reel; Resistance: 100R; Resistor Type: Thin Film; Termination: SMD/SMT; Number of Terminations: 2; Max Power Dissipation: 125mW; Series: ERA-6A; Resistance Tolerance: 0.1%; Construction: Rectangular; Voltage Rating (DC): 100V; Features: Automotive AEC-Q200; Package Quantity: 1; Technology: THIN FILM; Length: 2mm; Width: 1.25mm; Height: 0.5mm; Depth: 1.25mm; Radiation Hardening: No; REACH SVHC: No SVHC; Military Standard: Not; RoHS Compliant: Yes; Lead Free: Lead Free; ComponentLink1URL: https://datasheet.ciiva.com/11810/0900766b80beefcc-11810733.pdf?src-supplier=RSComponents; ComponentLink1Description: https://datasheet.ciiva.com/11810/0900766b80beefcc-11810733.pdf?src-supplier=RSComponents; ComponentLink2URL: https://datasheet.ciiva.com/29184/452698-da-01-en-widerstand-0805-era-29184051.pdf?src-supplier=Conrad; ComponentLink2Description: https://datasheet.ciiva.com/29184/452698-da-01-en-widerstand-0805-era-29184051.pdf?src-supplier=Conrad; ComponentLink3URL: https://datasheet.ciiva.com/16774/70068849-16774677.pdf?src-supplier=Allied+Electronics; ComponentLink3Description: https://datasheet.ciiva.com/16774/70068849-16774677.pdf?src-supplier=Allied+Electronics; ComponentLink4URL: https://datasheet.ciiva.com/22758/485442-22758149.pdf?src-supplier=Farnell; ComponentLink4Description: https://datasheet.ciiva.com/22758/485442-22758149.pdf?src-supplier=Farnell; ComponentLink5URL: https://datasheet.ciiva.com/46438/485442-46438213.pdf?src-supplier=Element14; ComponentLink5Description: https://datasheet.ciiva.com/46438/485442-46438213.pdf?src-supplier=Element14; ComponentLink6URL: https://datasheet.ciiva.com/46438/485442-46438214.pdf?src-supplier=Element14; ComponentLink6Description: https://datasheet.ciiva.com/46438/485442-46438214.pdf?src-supplier=Element14; ComponentLink7URL: https://datasheet.ciiva.com/16770/70068849-16770007.pdf?src-supplier=Allied+Electronics; ComponentLink7Description: https://datasheet.ciiva.com/16770/70068849-16770007.pdf?src-supplier=Allied+Electronics; ComponentLink8URL: https://datasheet.ciiva.com/30140/54aoa0000ce26-30140696.pdf?src-supplier=Onlinecomponents.com; ComponentLink8Description: https://datasheet.ciiva.com/30140/54aoa0000ce26-30140696.pdf?src-supplier=Onlinecomponents.com; ComponentLink9URL: https://datasheet.ciiva.com/17207/aoa0000ce26-17207961.pdf?src-supplier=Avnet+Europe; ComponentLink9Description: https://datasheet.ciiva.com/17207/aoa0000ce26-17207961.pdf?src-supplier=Avnet+Europe; ComponentLink10URL: https://datasheet.ciiva.com/24072/aoa0000ce26-32660-24072217.pdf?src-supplier=Mouser; ComponentLink10Description: https://datasheet.ciiva.com/24072/aoa0000ce26-32660-24072217.pdf?src-supplier=Mouser; ComponentLink11URL: https://datasheet.ciiva.com/28513/485442-28513850.pdf?src-supplier=Element14; ComponentLink11Description: https://datasheet.ciiva.com/28513/485442-28513850.pdf?src-supplier=Element14; ComponentLink12URL: https://datasheet.ciiva.com/48536/era-eng-tds-48536747.pdf?src-supplier=Distrelec; ComponentLink12Description: https://datasheet.ciiva.com/48536/era-eng-tds-48536747.pdf?src-supplier=Distrelec; ComponentLink13URL: https://datasheet.ciiva.com/16396/aoa0000ce26-16396828.pdf?src-supplier=Future+Electronics; ComponentLink13Description: https://datasheet.ciiva.com/16396/aoa0000ce26-16396828.pdf?src-supplier=Future+Electronics; ComponentLink14URL: https://datasheet.ciiva.com/9186/aoa0000ce26-9186749.pdf?src-supplier=Avnet; ComponentLink14Description: https://datasheet.ciiva.com/9186/aoa0000ce26-9186749.pdf?src-supplier=Avnet